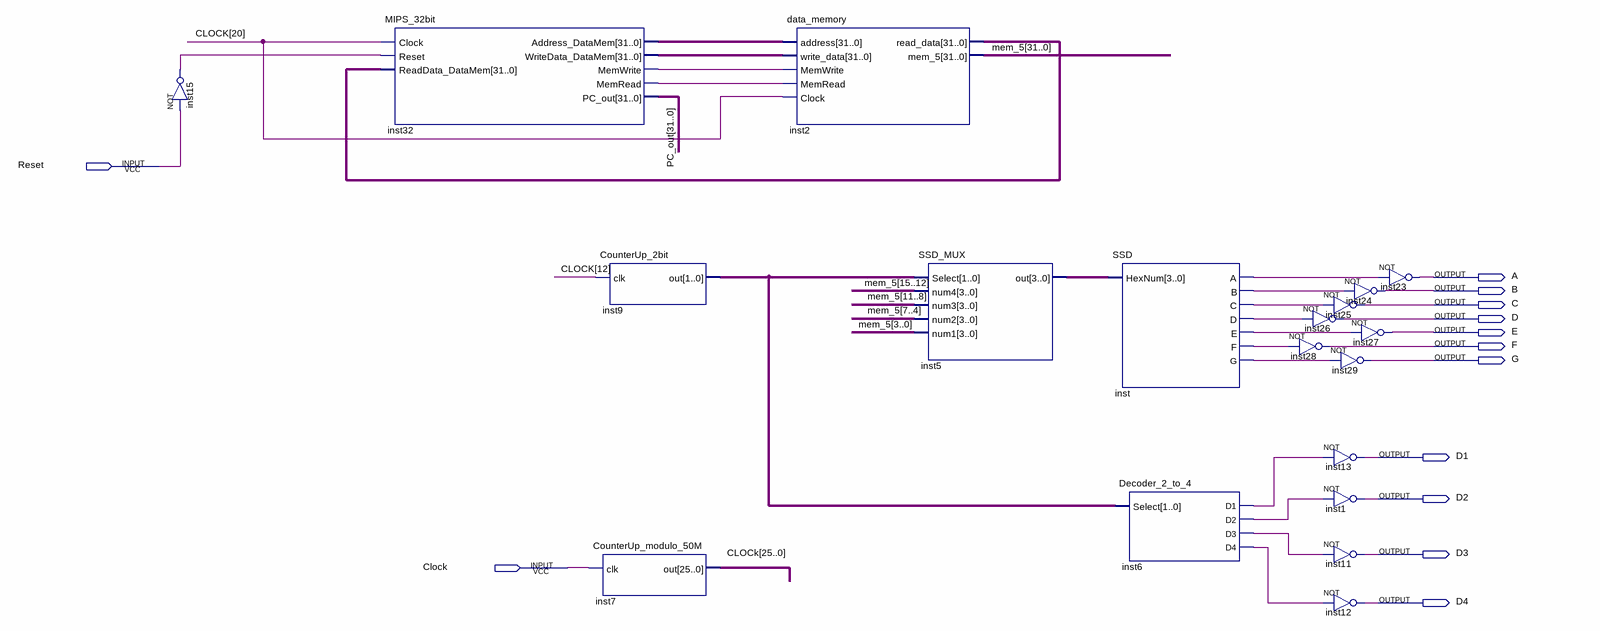
[diagram p0: schematic sheet]
// Quartus schematic Top_Level_Block.bdf as structural Verilog: 19 symbols, 13 pins
module Top_Level_Block (
  input  Reset,
  input  Clock,
  output A,
  output B,
  output C,
  output D,
  output E,
  output F,
  output G,
  output D1,
  output D2,
  output D3,
  output D4
);

  wire inst6_d1, inst6_d2, inst6_d3, inst6_d4, inst15_out, inst32_memread, inst32_memwrite, inst_a, inst_b,
       inst_c, inst_d, inst_e, inst_f, inst_g;
  wire [1:0] inst9_out;
  wire [3:0] inst5_out;
  wire [25:0] Clock_bus;
  wire [31:0] inst2_read_data, inst32_address_datamem, inst32_writedata_datamem, mem_5, PC_out;

  not inst15 (inst15_out, Reset);
  MIPS_32bit inst32 (
    .Clock(Clock_bus[20]), .Reset(inst15_out), .ReadData_DataMem(inst2_read_data),
    .Address_DataMem(inst32_address_datamem), .WriteData_DataMem(inst32_writedata_datamem),
    .MemWrite(inst32_memwrite), .MemRead(inst32_memread), .PC_out(PC_out));
  CounterUp_2bit inst9 (.clk(Clock_bus[12]), .out(inst9_out));
  CounterUp_modulo_50M inst7 (.clk(Clock), .out(Clock_bus));
  data_memory inst2 (
    .address(inst32_address_datamem), .write_data(inst32_writedata_datamem), .MemWrite(inst32_memwrite),
    .MemRead(inst32_memread), .Clock(Clock_bus[20]), .read_data(inst2_read_data), .mem_5(mem_5));
  SSD_MUX inst5 (
    .Select(inst9_out), .num4(mem_5[15:12]), .num3(mem_5[11:8]), .num2(mem_5[7:4]), .num1(mem_5[3:0]),
    .out(inst5_out));
  SSD inst (.HexNum(inst5_out), .A(inst_a), .B(inst_b), .C(inst_c), .D(inst_d), .E(inst_e), .F(inst_f), .G(inst_g));
  Decoder_2_to_4 inst6 (.Select(inst9_out), .D1(inst6_d1), .D2(inst6_d2), .D3(inst6_d3), .D4(inst6_d4));
  not inst28 (F, inst_f);
  not inst24 (B, inst_b);
  not inst25 (C, inst_c);
  not inst26 (D, inst_d);
  not inst27 (E, inst_e);
  not inst29 (G, inst_g);
  not inst13 (D1, inst6_d1);
  not inst1 (D2, inst6_d2);
  not inst11 (D3, inst6_d3);
  not inst12 (D4, inst6_d4);
  not inst23 (A, inst_a);
endmodule
